# Altium project FLEXI_HAL_2000.PrjPCB (part 3 of 3)
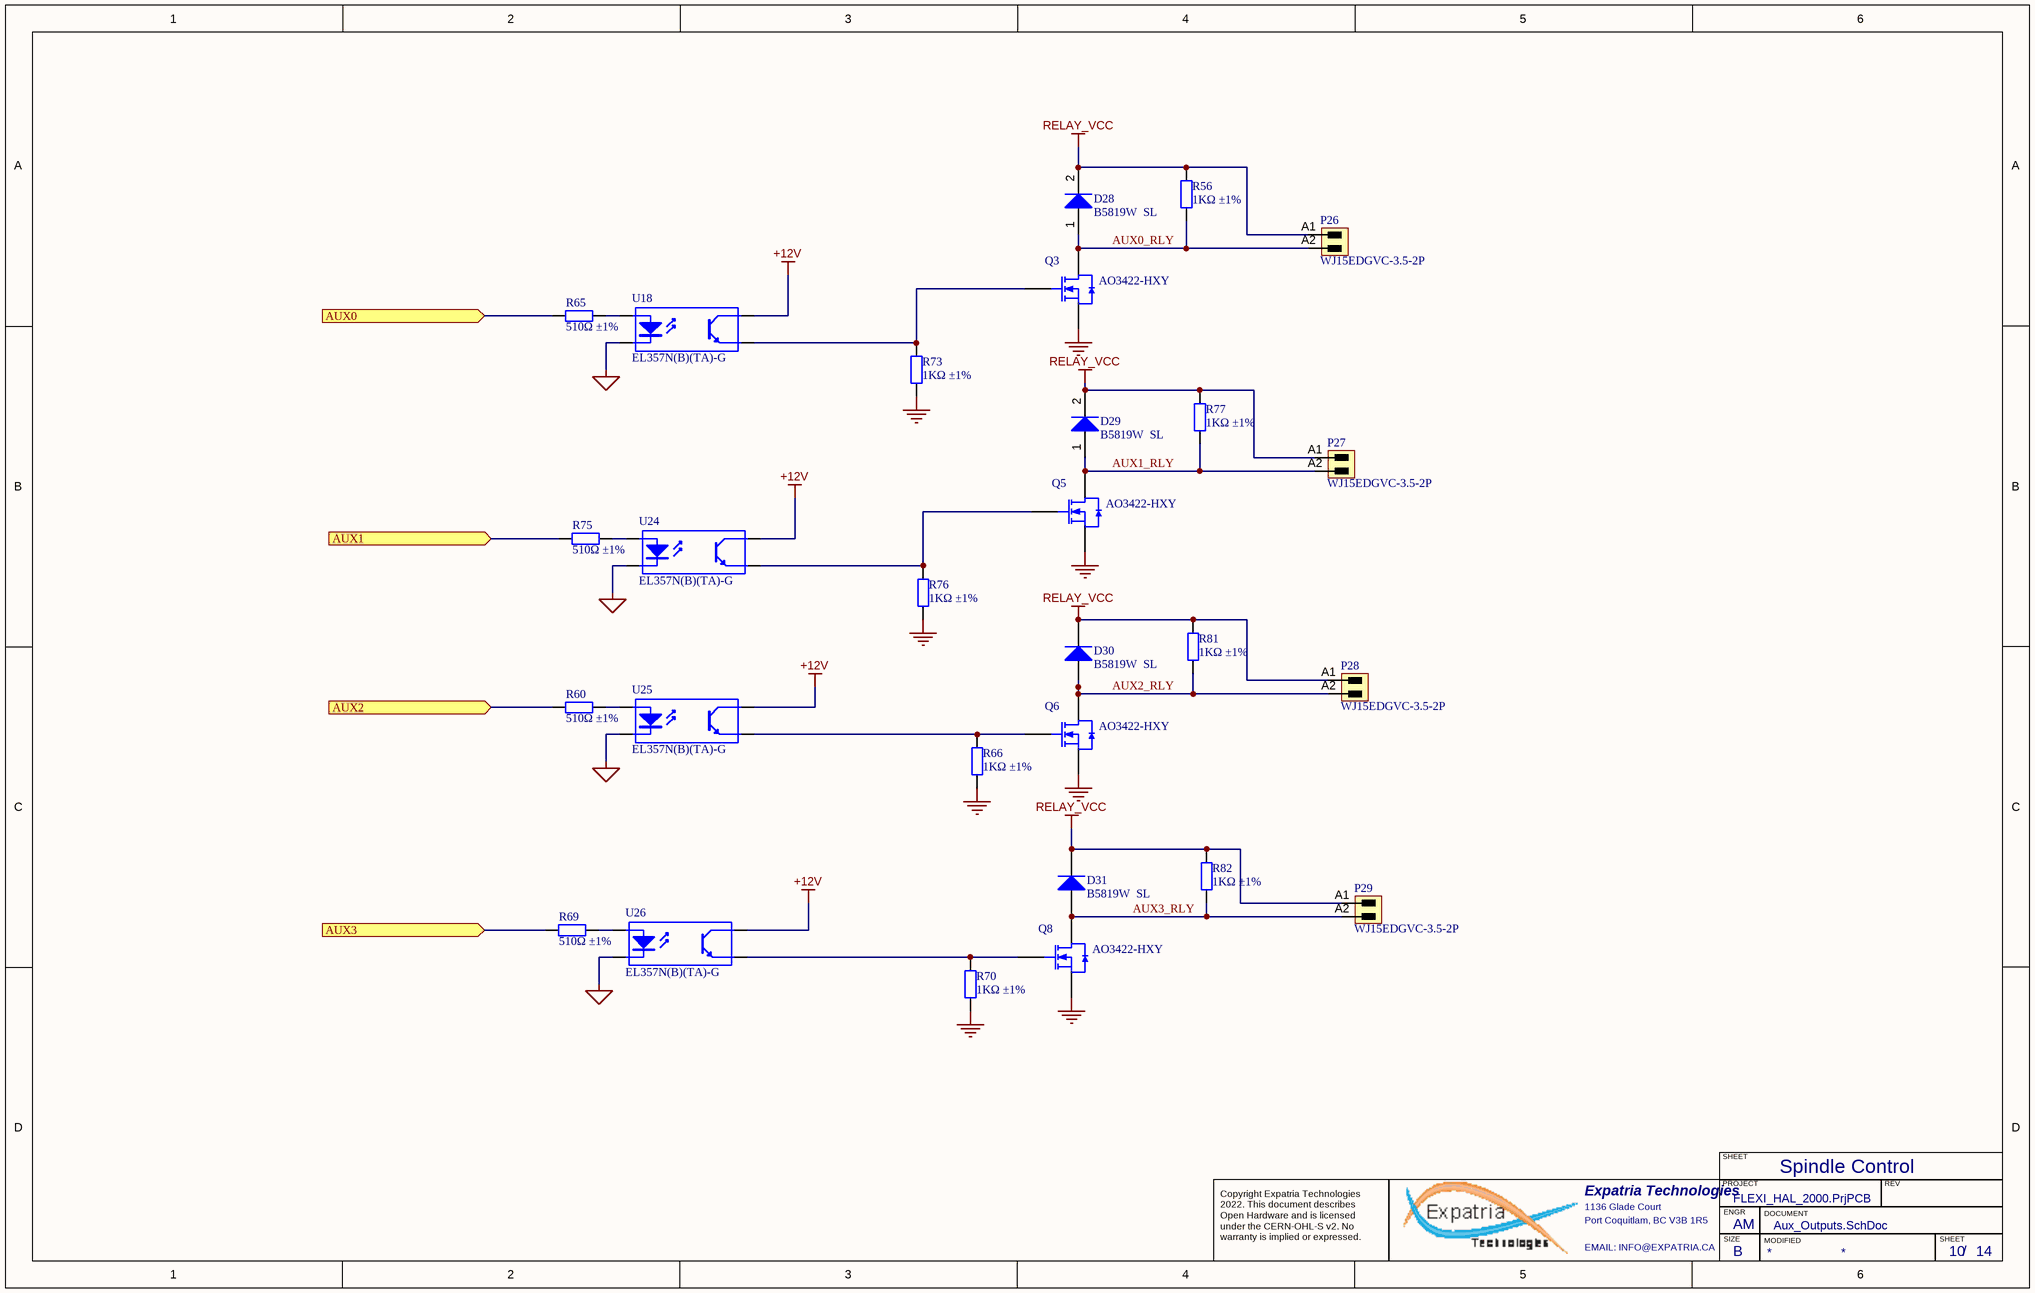
[diagram p15: Aux_Outputs.SchDoc]

## Nets that join several sheets
+3.3V: STM32F446RE_board (8 pins), Limit_Switches (5 pins), STM32F446 CNC Controller/LIM_SW/LS_X (R20_LS_X.2), STM32F446 CNC Controller/LIM_SW/LS_Y (R20_LS_Y.2), STM32F446 CNC Controller/LIM_SW/LS_Z (R20_LS_Z.2), STM32F446 CNC Controller/LIM_SW/LS_A (R20_LS_A.2), STM32F446 CNC Controller/LIM_SW/LS_B (R20_LS_B.2), Misc_switches (5 pins), STM32F446 CNC Controller/USR_SW/PH_CY (R20_PH_CY.2), STM32F446 CNC Controller/USR_SW/PH_FD (R20_PH_FD.2), STM32F446 CNC Controller/USR_SW/PH_DR (R20_PH_DR.2), 2xparallelswitch (R3.2), 2xparallelswitch_HALT (R53.2 R93.2 U21.4), Stepper_driver_group (11 pins), I2C_Keypad (P14.1), RS485 (C7.1 R49.1 U9.1), MCU_STM32F446RE (27 pins)
+5V: STM32F446RE_board (10 pins), Stepper_driver_group (30 pins), Spindle_Control (P6.1), RS485 (6 pins), Spindle_Sync (5 pins), 5V_Power_Supply (6 pins)
+5V_MCU: STM32F446RE_board (9 pins), I2C_Keypad (P11.1), MCU_STM32F446RE (C58.2 VR4.3)
+12V: STM32F446RE_board (5 pins), Limit_Switches (J9.1), STM32F446 CNC Controller/LIM_SW/LS_X (J3_LS_X.A1 R21_LS_X.1), STM32F446 CNC Controller/LIM_SW/LS_Y (J3_LS_Y.A1 R21_LS_Y.1), STM32F446 CNC Controller/LIM_SW/LS_Z (J3_LS_Z.A1 R21_LS_Z.1), STM32F446 CNC Controller/LIM_SW/LS_A (J3_LS_A.A1 R21_LS_A.1), STM32F446 CNC Controller/LIM_SW/LS_B (J3_LS_B.A1 R21_LS_B.1), Misc_switches (J12.1), STM32F446 CNC Controller/USR_SW/PH_CY (J3_PH_CY.A1 R21_PH_CY.1), STM32F446 CNC Controller/USR_SW/PH_FD (J3_PH_FD.A1 R21_PH_FD.1), STM32F446 CNC Controller/USR_SW/PH_DR (J3_PH_DR.A1 R21_PH_DR.1), 2xparallelswitch (5 pins), 2xparallelswitch_HALT (J13.A1 R45.2 R57.2 R91.2), Spindle_Control (5 pins), Aux_Outputs (U18.4 U24.4 U25.4 U26.4)
+24V: STM32F446RE_board (6 pins), Spindle_Control (6 pins), 5V_Power_Supply (C46.2 C47.2 U23.2)
GND: STM32F446RE_board (19 pins), Limit_Switches (J9.2), STM32F446 CNC Controller/LIM_SW/LS_X (J3_LS_X.A3), STM32F446 CNC Controller/LIM_SW/LS_Y (J3_LS_Y.A3), STM32F446 CNC Controller/LIM_SW/LS_Z (J3_LS_Z.A3), STM32F446 CNC Controller/LIM_SW/LS_A (J3_LS_A.A3), STM32F446 CNC Controller/LIM_SW/LS_B (J3_LS_B.A3), Misc_switches (J12.2), STM32F446 CNC Controller/USR_SW/PH_CY (J3_PH_CY.A3), STM32F446 CNC Controller/USR_SW/PH_FD (J3_PH_FD.A3), STM32F446 CNC Controller/USR_SW/PH_DR (J3_PH_DR.A3), 2xparallelswitch (J1.A3 J2.A3), 2xparallelswitch_HALT (J13.A3), Stepper_driver_group (32 pins), Spindle_Control (7 pins), RS485 (7 pins), Spindle_Sync (5 pins), 5V_Power_Supply (12 pins), Aux_Outputs (8 pins)
MCU_GND: STM32F446RE_board (28 pins), STM32F446 CNC Controller/LIM_SW/LS_X (C54_LS_X.1 U2_LS_X.3), STM32F446 CNC Controller/LIM_SW/LS_Y (C54_LS_Y.1 U2_LS_Y.3), STM32F446 CNC Controller/LIM_SW/LS_Z (C54_LS_Z.1 U2_LS_Z.3), STM32F446 CNC Controller/LIM_SW/LS_A (C54_LS_A.1 U2_LS_A.3), STM32F446 CNC Controller/LIM_SW/LS_B (C54_LS_B.1 U2_LS_B.3), STM32F446 CNC Controller/USR_SW/PH_CY (C54_PH_CY.1 U2_PH_CY.3), STM32F446 CNC Controller/USR_SW/PH_FD (C54_PH_FD.1 U2_PH_FD.3), STM32F446 CNC Controller/USR_SW/PH_DR (C54_PH_DR.1 U2_PH_DR.3), 2xparallelswitch (C5.1 U1.3), 2xparallelswitch_HALT (C10.1 Q12.2 Q13.2 R94.1), Stepper_driver_group (12 pins), Spindle_Control (6 pins), I2C_Keypad (P11.5 P14.4), RS485 (C7.2 C60.2 Q4.2 U9.4), MCU_STM32F446RE (36 pins), Aux_Outputs (U18.2 U24.2 U25.2 U26.2)
RELAY_VCC: STM32F446RE_board (5 pins), Aux_Outputs (12 pins)
A_LIM: Limit_Switches (R46.2), STM32F446 CNC Controller/LIM_SW/LS_A (C54_LS_A.2 R20_LS_A.1 U2_LS_A.4), MCU_STM32F446RE (U22.58)
A_LIM_ext: Limit_Switches (J9.6), STM32F446 CNC Controller/LIM_SW/LS_A (J3_LS_A.A2 U2_LS_A.2)
AUXOUT_0: MCU_STM32F446RE (U22.34), Aux_Outputs (R65.1)
AUXOUT_1: MCU_STM32F446RE (U22.26), Aux_Outputs (R75.1)
AUXOUT_2: MCU_STM32F446RE (U22.20), Aux_Outputs (R60.1)
AUXOUT_3: MCU_STM32F446RE (U22.22), Aux_Outputs (R69.1)
B_LIM: STM32F446RE_board (R44.1), Limit_Switches (R47.2), STM32F446 CNC Controller/LIM_SW/LS_B (C54_LS_B.2 R20_LS_B.1 U2_LS_B.4), MCU_STM32F446RE (U22.3)
COOLANT: Spindle_Control (R25.1), MCU_STM32F446RE (U22.40)
CYC/ST: Misc_switches (R11.2), STM32F446 CNC Controller/USR_SW/PH_CY (C54_PH_CY.2 R20_PH_CY.1 U2_PH_CY.4), MCU_STM32F446RE (U22.52)
CYC/ST_out: Misc_switches (J12.3), STM32F446 CNC Controller/USR_SW/PH_CY (J3_PH_CY.A2 U2_PH_CY.2)
DIR_A: Stepper_driver_group (U31.3), MCU_STM32F446RE (U22.53)
DIR_B: Stepper_driver_group (U33.3), MCU_STM32F446RE (U22.36)
DIR_X: Stepper_driver_group (U17.3), MCU_STM32F446RE (U22.10)
DIR_Y: Stepper_driver_group (U12.3), MCU_STM32F446RE (U22.8)
DIR_Z: Stepper_driver_group (U29.3), MCU_STM32F446RE (U22.4)
DOOR: STM32F446RE_board (R43.1), Misc_switches (R74.2), STM32F446 CNC Controller/USR_SW/PH_DR (C54_PH_DR.2 R20_PH_DR.1 U2_PH_DR.4), MCU_STM32F446RE (U22.24)
DOOR_out: Misc_switches (J12.6), STM32F446 CNC Controller/USR_SW/PH_DR (J3_PH_DR.A2 U2_PH_DR.2)
EXT_IN0: STM32F446RE_board (U15.2), Spindle_Sync (U10.3)
EXT_IN0_BUF: STM32F446RE_board (U15.7), MCU_STM32F446RE (U22.14)
EXT_IN1: STM32F446RE_board (U15.3), Spindle_Sync (U10.5)
EXT_IN1_BUF: STM32F446RE_board (U15.6), MCU_STM32F446RE (U22.15)
EXT_IN2: STM32F446RE_board (U16.2), Spindle_Sync (U10.11)
EXT_IN2_BUF: STM32F446RE_board (U16.7), MCU_STM32F446RE (U22.16)
FD/HLD: Misc_switches (R14.2), STM32F446 CNC Controller/USR_SW/PH_FD (C54_PH_FD.2 R20_PH_FD.1 U2_PH_FD.4), MCU_STM32F446RE (U22.39)
HALT_n: STM32F446RE_board (R79.1), Misc_switches (R15.2), 2xparallelswitch_HALT (C10.2 P12.2), I2C_Keypad (P11.3), MCU_STM32F446RE (U22.33)
HALT_out: Misc_switches (J12.5), 2xparallelswitch_HALT (D32.2 D33.2 R91.1)
HOLD_out: Misc_switches (J12.4), STM32F446 CNC Controller/USR_SW/PH_FD (J3_PH_FD.A2 U2_PH_FD.2)
KPSTR: STM32F446RE_board (A1.15), I2C_Keypad (P11.4), MCU_STM32F446RE (R42.1 U22.29)
MAXLIM: Limit_Switches (J9.8), 2xparallelswitch (D20.2 D22.2 J2.A2 R8.1)
MINLIM: Limit_Switches (J9.7), 2xparallelswitch (D20.1 D22.1 J1.A2 R4.1)
MIST: Spindle_Control (R30.1), MCU_STM32F446RE (U22.23)
PROBE: Misc_switches (R10.2), 2xparallelswitch (C5.2 R3.1 U1.4), MCU_STM32F446RE (U22.59)
PRU_RESET: STM32F446RE_board (A1.22), MCU_STM32F446RE (U22.11)
RXD_EXT: STM32F446RE_board (A1.29 P10.3 P19.6 U16.6), MCU_STM32F446RE (R39.1 U22.25)
RXD_INT: STM32F446RE_board (P19.1), MCU_STM32F446RE (U22.43)
RXD_OUT: STM32F446RE_board (U16.3), RS485 (R98.1 U11.1)
SCL: STM32F446RE_board (A1.5), I2C_Keypad (P14.2), MCU_STM32F446RE (R64.1 U22.37 U27.6)
SDA: STM32F446RE_board (A1.3), I2C_Keypad (P14.3), MCU_STM32F446RE (R63.1 U22.38 U27.5)
SPI_CLK: STM32F446RE_board (A1.23), MCU_STM32F446RE (R17.2)
SPI_CS_JOG_SW: STM32F446RE_board (A1.24), MCU_STM32F446RE (U22.50)
SPI_MISO: STM32F446RE_board (A1.21), MCU_STM32F446RE (R58.2)
SPI_MOSI: STM32F446RE_board (A1.19), MCU_STM32F446RE (R83.2)
SPINDLE_DIR: Spindle_Control (R35.1), MCU_STM32F446RE (U22.27)
SPINDLE_EN: Spindle_Control (R23.1 R37.1), MCU_STM32F446RE (R51.2 U22.28)
SPINDLE_PWM: Spindle_Control (R9.1), MCU_STM32F446RE (U22.41)
STEP_A: Stepper_driver_group (U31.2), MCU_STM32F446RE (U22.54)
STEP_B: Stepper_driver_group (U33.2), MCU_STM32F446RE (U22.35)
STEP_DISABLE_n: STM32F446RE_board (U13.7), Stepper_driver_group (P21.6 P22.6 P24.6 P25.6)
STEP_DISABLE_Z_n: STM32F446RE_board (U13.6), Stepper_driver_group (P23.6)
STEP_EN: STM32F446RE_board (R55.2 U13.2), MCU_STM32F446RE (J11.2 U22.49)
STEP_EN_Z: STM32F446RE_board (R54.2 U13.3), MCU_STM32F446RE (J10.2 U22.46)
STEP_X: Stepper_driver_group (U17.2), MCU_STM32F446RE (U22.17)
STEP_Y: Stepper_driver_group (U12.2), MCU_STM32F446RE (U22.9)
STEP_Z: Stepper_driver_group (U29.2), MCU_STM32F446RE (U22.61)
STM_BOOT0: STM32F446RE_board (R1.1), MCU_STM32F446RE (C57.2 R62.1 SW3.1 U22.60)
STM_RESET: STM32F446RE_board (A1.11), MCU_STM32F446RE (6 pins)
STP_ALARM: STM32F446RE_board (R18.2), Stepper_driver_group (C40.2 R28.1 U20.4)
TXD_EXT: STM32F446RE_board (A1.7 P10.2 P19.5), RS485 (D14.2 R61.1 U9.2), MCU_STM32F446RE (R40.1 U22.51)
TXD_INT: STM32F446RE_board (P19.2), MCU_STM32F446RE (U22.42)
USB_D_N: STM32F446RE_board (J5.A7 J5.B7), MCU_STM32F446RE (R71.2)
USB_D_P: STM32F446RE_board (J5.A6 J5.B6), MCU_STM32F446RE (R72.2)
X_LIM: Limit_Switches (R6.2), STM32F446 CNC Controller/LIM_SW/LS_X (C54_LS_X.2 R20_LS_X.1 U2_LS_X.4), MCU_STM32F446RE (U22.21)
X_LIM_ext: Limit_Switches (J9.3), STM32F446 CNC Controller/LIM_SW/LS_X (J3_LS_X.A2 U2_LS_X.2)
Y_LIM: Limit_Switches (R16.2), STM32F446 CNC Controller/LIM_SW/LS_Y (C54_LS_Y.2 R20_LS_Y.1 U2_LS_Y.4), MCU_STM32F446RE (U22.62)
Y_LIM_ext: Limit_Switches (J9.4), STM32F446 CNC Controller/LIM_SW/LS_Y (J3_LS_Y.A2 U2_LS_Y.2)
Z_LIM: Limit_Switches (R41.2), STM32F446 CNC Controller/LIM_SW/LS_Z (C54_LS_Z.2 R20_LS_Z.1 U2_LS_Z.4), MCU_STM32F446RE (U22.2)
Z_LIM_ext: Limit_Switches (J9.5), STM32F446 CNC Controller/LIM_SW/LS_Z (J3_LS_Z.A2 U2_LS_Z.2)

## Assembly variants
SMT_ONLY: not fitted A1 J1_LS_A J1_LS_X J1_LS_Y J1_LS_Z J2_LS_A J2_LS_X J2_LS_Y J2_LS_Z J3_PH_CY J3_PH_CY J3_PH_FD J3_PH_HLT J3_PH_PR J4 J6 J6 J7 J8 J8 J9 P1 P2 P2 P3 P3 P4 P4 P5 P5 P6 P6 P7 P7 P8 P9 P9 P10 P10 P11 P11 P12 P12 P13 P13 P14 P14 P16 P16 P17 P18 P19 P19 P20 P20 P21 P21 P22 P22 P23 P23 P24 P24 P25 P25 P26 P27 P28 P29 R? U30
FULL_PLACE: not fitted P1 P8 P8 P18 P18 P20 R43 R44 R? U30